# EAGLE design Bracelet (EAGLE 7.1.0)
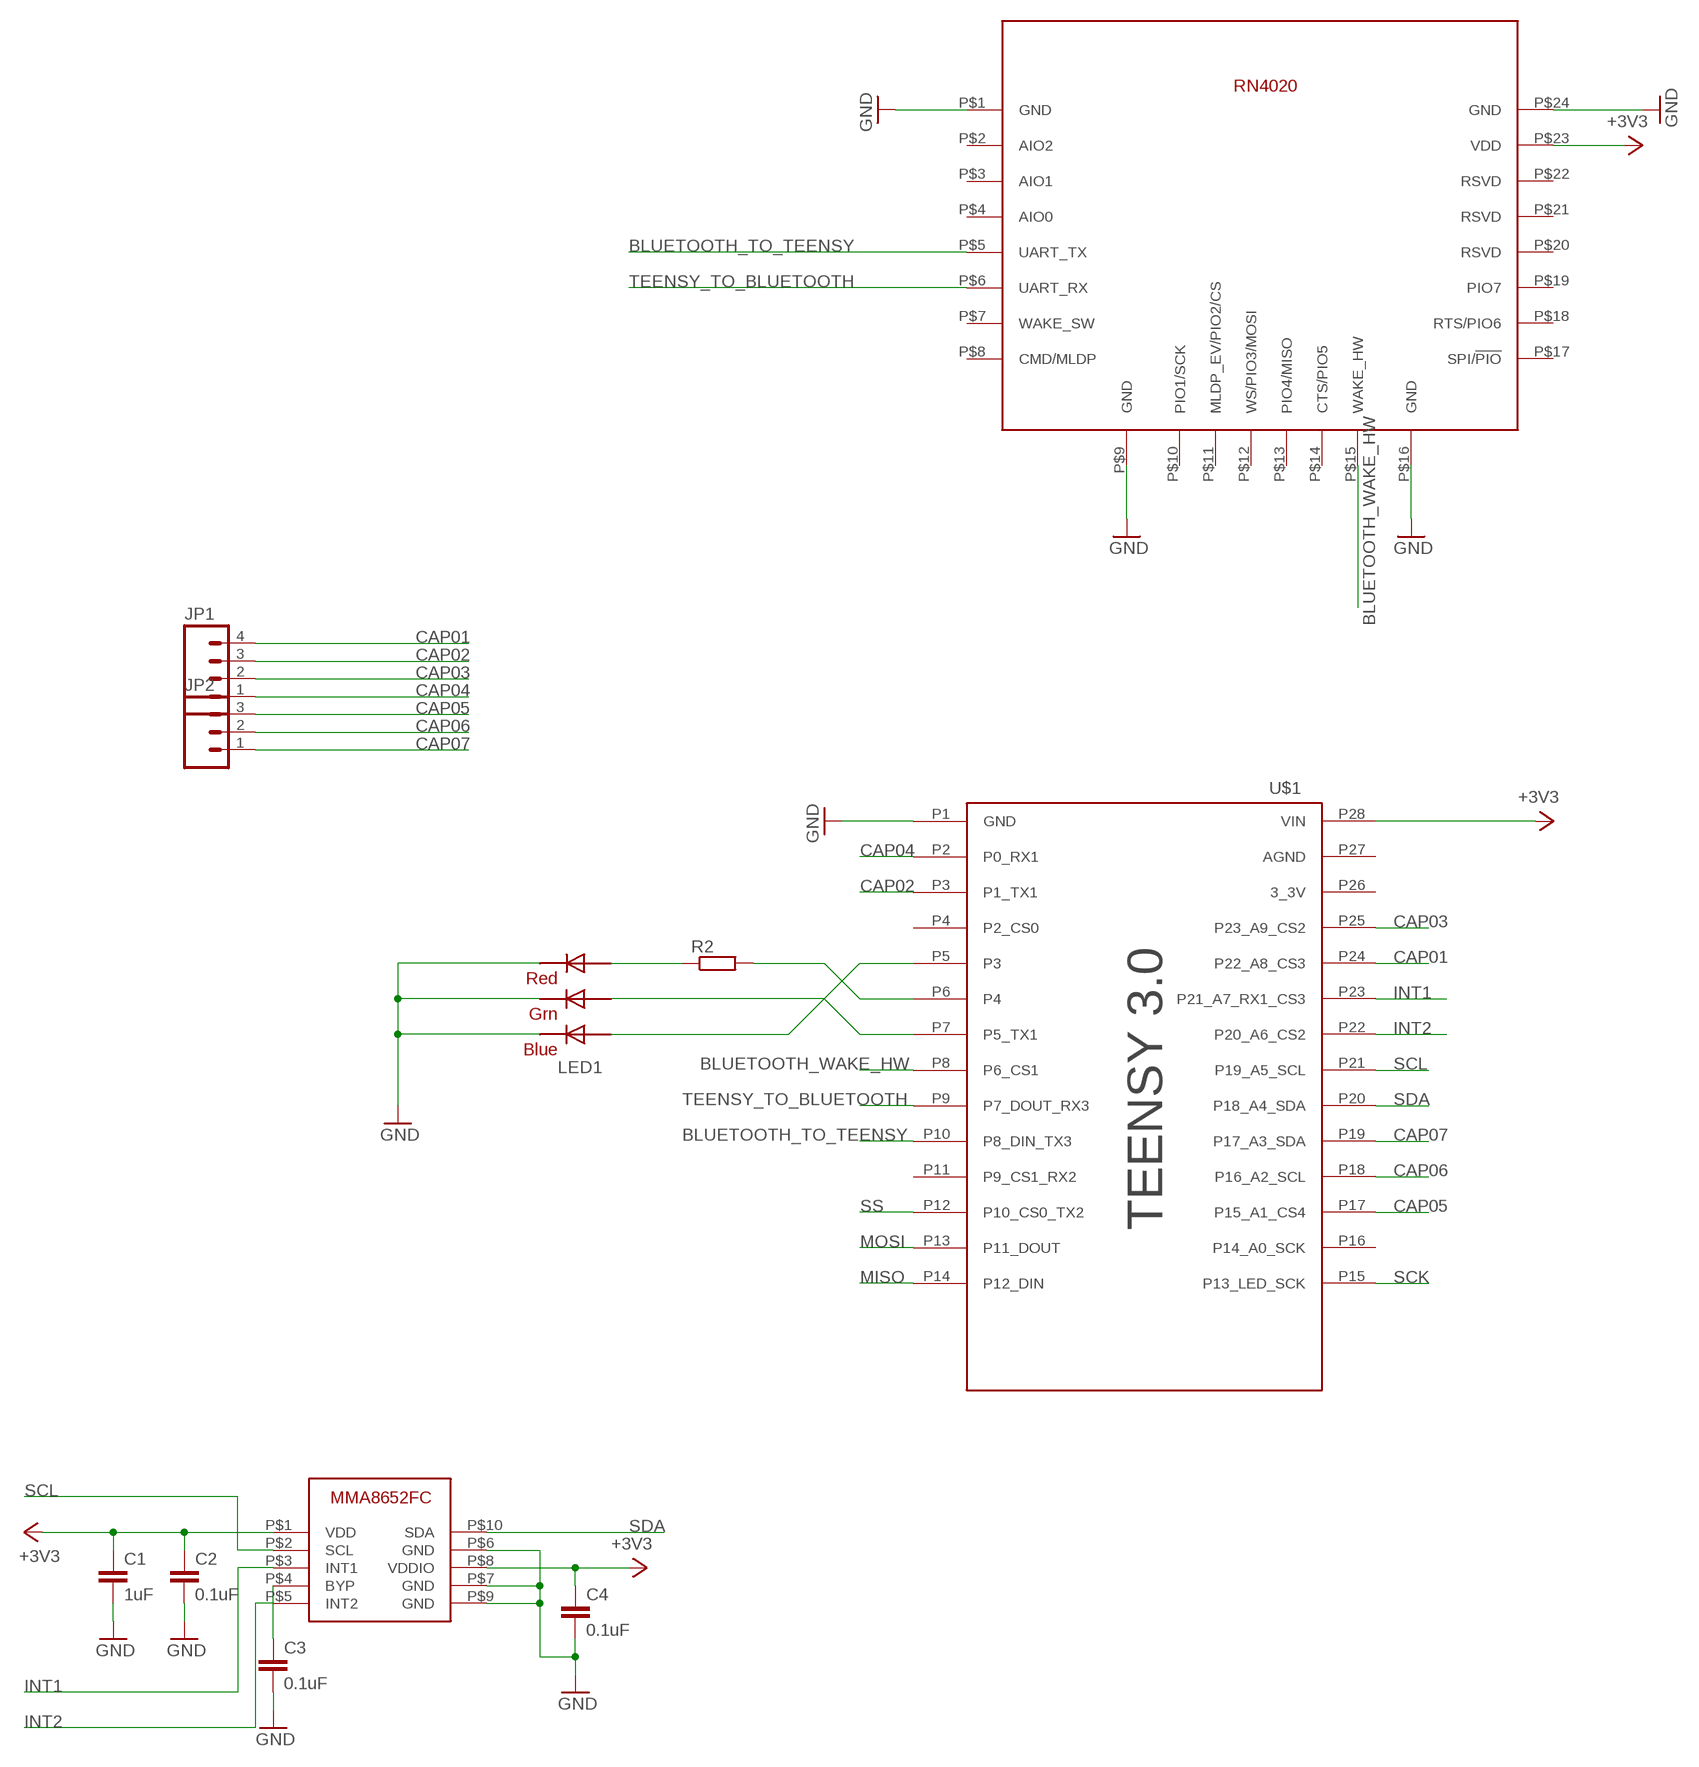
[diagram p0: schematic, sheet 1]

## Parts
C1  1uF  C-EUC0805  [C0805]
C2  0.1uF  C-EUC0805  [C0805]
C3  0.1uF  C-EUC0805  [C0805]
C4  0.1uF  C-EUC0805  [C0805]
JP1  M04PTH  [1X04]
JP2  M03PTH  [1X03]
LED1  RGBLED5050  [RGBLED5050]
R2  R-EU_R0805  [R0805]
RN4020  RN4020  [RN4020]
U$1  TEENSY3  [TEENSY3_BRD]
U$3  MMA8652FC  [MMA8652FC]

## Nets
+3V3: C1.1 C2.1 C4.1 RN4020.P$23(VDD) U$1.P28(VIN) U$3.P$1(VDD) U$3.P$8(VDDIO)
BLUETOOTH_TO_TEENSY: RN4020.P$5(UART_TX) U$1.P10(P8_DIN_TX3)
BLUETOOTH_WAKE_HW: RN4020.P$15(WAKE_HW) U$1.P8(P6_CS1)
CAP01: JP1.4 U$1.P24(P22_A8_CS3)
CAP02: JP1.3 U$1.P3(P1_TX1)
CAP03: JP1.2 U$1.P25(P23_A9_CS2)
CAP04: JP1.1 U$1.P2(P0_RX1)
CAP05: JP2.3 U$1.P17(P15_A1_CS4)
CAP06: JP2.2 U$1.P18(P16_A2_SCL)
CAP07: JP2.1 U$1.P19(P17_A3_SDA)
GND: C1.2 C2.2 C3.2 C4.2 LED1.4(BLUE_C) LED1.5(RED_C) LED1.6(GREEN_C) RN4020.P$1(GND) RN4020.P$9(GND) RN4020.P$16(GND) RN4020.P$24(GND) U$1.P1(GND) U$3.P$6(GND) U$3.P$7(GND) U$3.P$9(GND)
INT1: U$1.P23(P21_A7_RX1_CS3) U$3.P$3(INT1)
INT2: U$1.P22(P20_A6_CS2) U$3.P$5(INT2)
MISO: U$1.P14(P12_DIN)
MOSI: U$1.P13(P11_DOUT)
N$1: C3.1 U$3.P$4(BYP)
N$2: LED1.2(RED_A) R2.1
N$4: R2.2 U$1.P6(P4)
N$5: LED1.3(BLUE_A) U$1.P5(P3)
N$6: LED1.1(GREEN_A) U$1.P7(P5_TX1)
SCK: U$1.P15(P13_LED_SCK)
SCL: U$1.P21(P19_A5_SCL) U$3.P$2(SCL)
SDA: U$1.P20(P18_A4_SDA) U$3.P$10(SDA)
SS: U$1.P12(P10_CS0_TX2)
TEENSY_TO_BLUETOOTH: RN4020.P$6(UART_RX) U$1.P9(P7_DOUT_RX3)
Unconnected: RN4020.P$2(AIO2) RN4020.P$3(AIO1) RN4020.P$4(AIO0) RN4020.P$7(WAKE_SW) RN4020.P$8(CMD/MLDP) RN4020.P$10(PIO1/SCK) RN4020.P$11(MLDP_EV/PIO2/CS) RN4020.P$12(WS/PIO3/MOSI) RN4020.P$13(PIO4/MISO) RN4020.P$14(CTS/PIO5) RN4020.P$17(SPI/!PIO) RN4020.P$18(RTS/PIO6) RN4020.P$19(PIO7) RN4020.P$20(RSVD) RN4020.P$21(RSVD) RN4020.P$22(RSVD) U$1.P4(P2_CS0) U$1.P11(P9_CS1_RX2) U$1.P16(P14_A0_SCK) U$1.P26(3_3V) U$1.P27(AGND)

## Library data of the parts
C1-C4 = rcl:C-EU: CAPACITOR, European symbol
JP1 = SparkFun-Connectors:M04: Header 4 Standard 4-pin 0.1" header. Use with straight break away headers (SKU : PRT-00116), right angle break away headers (PRT-00553), swiss pins (PRT-00743), machine pins (PRT-00117), and female headers (PRT-00115). Molex polarized connector foot print use with SKU : PRT-08231 with associated crimp pins and housings. 1MM SMD Version SKU: PRT-10208
JP2 = SparkFun-Connectors:M03: Header 3 Standard 3-pin 0.1" header. Use with straight break away headers (SKU : PRT-00116), right angle break away headers (PRT-00553), swiss pins (PRT-00743), machine pins (PRT-00117), and female headers (PRT-00115). Molex polarized connector foot print use with SKU : PRT-08232 with associated crimp pins and housings.
LED1 = adafruit:RGBLED: For 5050 RGB LEDs, the order of the LEDs may vary from one manufacturer to another!
R2 = resistor:R-EU_: RESISTOR, European symbol
RN4020 = talons:RN4020: RN4020 Bluetooth Low Energy Module http://www.microchip.com/wwwproducts/Devices.aspx?product=RN4020
U$1 = teensy_base_compatible:TEENSY3
U$3 = talons:MMA8652FC

## Board
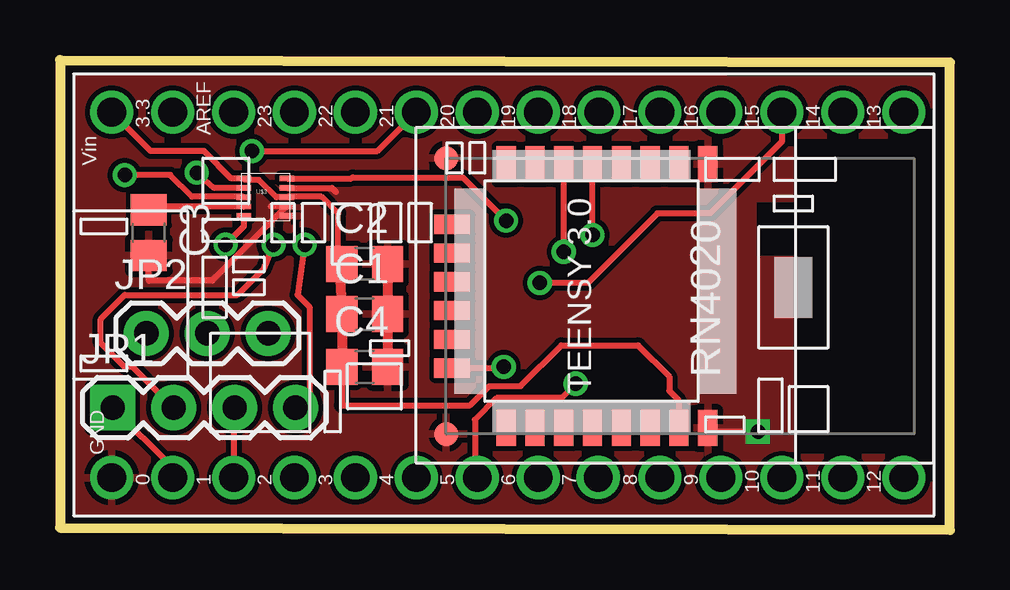
[diagram p1: board, top side]
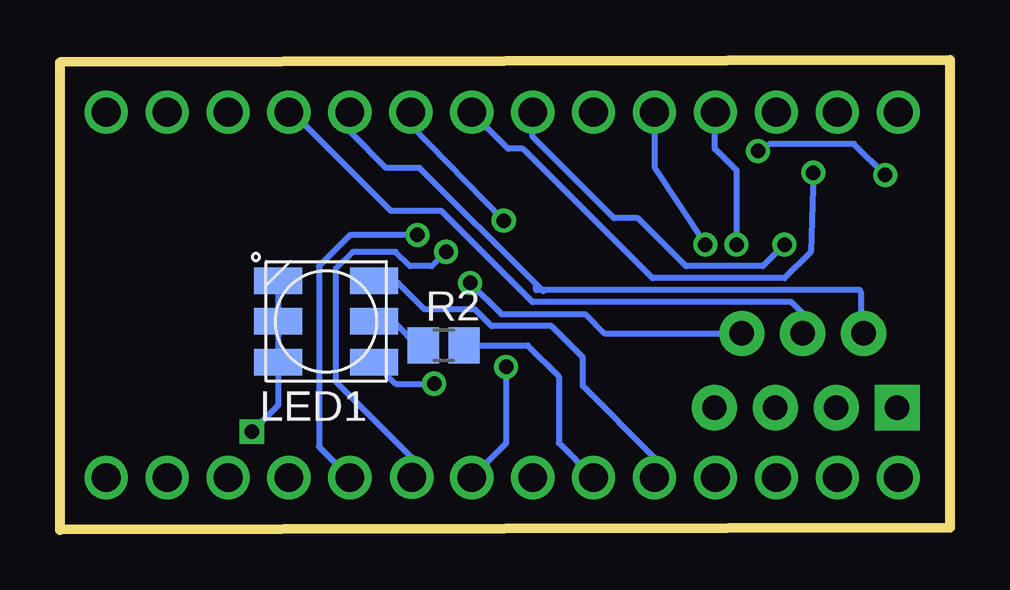
[diagram p2: board, bottom side, seen from below]

Size 37.1 x 19.6 mm. Coordinates in mm from the lower left corner, seen from the top.
Outline: 0,0.1 37.1,0 37.1,19.5 0,19.6 0,0.1
Copper layers (1*16): Top 0.0178mm / dielectric 59mil / Bottom 0.0178mm
Design rules "epl-lpkf": minimum track width 8mil, minimum drill 0.35mm, track to track 8mil, track to pad 8mil, pad to pad 8mil, via to via 8mil, smd to smd 8mil, copper to edge 15mil, drill to drill 15mil, minimum pad ring 8mil, minimum via ring 8mil, stop-mask expansion 3mil, vias tented up to drill 0mil, thermal gap 10mil
tRestrict: area 30.6,3.2 to 36.8,16.3

### Footprints (pad centres in the part's own frame; a part is rotated, then mirrored left to right if it is on the bottom)
C0805 = smd 1.3 x 1.5: 1 -0.95,0; 2 0.95,0
1X04 = drill 1.016 pad 1.88 square: 1 0,0 | drill 1.016 pad 1.88: 2 2.54,0; 3 5.08,0; 4 7.62,0
1X03 = drill 1.016 pad 1.88: 1 0,0; 2 2.54,0; 3 5.08,0
RGBLED5050 = smd 2 x 1.1: 1 -2,1.7; 2 -2,0; 3 -2,-1.7; 4 2,-1.7; 5 2,0; 6 2,1.7
R0805 = smd 1.3 x 1.5: 1 -0.85,0; 2 0.85,0
RN4020 = smd 1.5 x 0.8: P$1 0.25,10.9; P$2 0.25,9.7; P$3 0.25,8.5; P$4 0.25,7.3; P$5 0.25,6.1; P$6 0.25,4.9; P$7 0.25,3.7; P$8 0.25,2.5; P$17 11.25,2.5; P$18 11.25,3.7; P$19 11.25,4.9; P$20 11.25,6.1; P$21 11.25,7.3; P$22 11.25,8.5; P$23 11.25,9.7; P$24 11.25,10.9 | smd 1 x 1: P$9 0,0; P$16 11.5,0 | smd 0.8 x 1.5: P$10 2.75,0.25; P$11 3.95,0.25; P$12 5.15,0.25; P$13 6.35,0.25; P$14 7.55,0.25; P$15 8.75,0.25
TEENSY3_BRD = drill 1.2: P1 -7.62,17.145; P2 -7.62,14.605; P3 -7.62,12.065; P4 -7.62,9.525; P5 -7.62,6.985; P6 -7.62,4.445; P7 -7.62,1.905; P8 -7.62,-0.635; P9 -7.612,-3.135; P10 -7.62,-5.715; P11 -7.62,-8.255; P12 -7.62,-10.795; P13 -7.62,-13.335; P14 -7.62,-15.875; P15 7.62,-15.875; P16 7.62,-13.335; P17 7.62,-10.795; P18 7.62,-8.255; P19 7.62,-5.715; P20 7.62,-3.175; P21 7.62,-0.635; P22 7.62,1.905; P23 7.62,4.445; P24 7.62,6.985; P25 7.62,9.525; P26 7.62,12.065; P27 7.62,14.605; P28 7.62,17.145
MMA8652FC = smd 0.6 x 0.225: P$1 0.362,1.755; P$2 0.362,1.365; P$3 0.362,0.975; P$4 0.362,0.585; P$5 0.362,0.195; P$6 2.163,0.195; P$7 2.163,0.585; P$8 2.163,0.975; P$9 2.163,1.365; P$10 2.163,1.755

### Placement (x,y rotation side)
C1  12.7,9 0 top
C2  12.7,11.1 0 top
C3  3.7,12.4 270 top
C4  12.7,6.8 0 top
JP1  2.2,5.1 0 top
JP2  3.6,8.2 0 top
LED1  26,8.7 180 bottom
R2  21.1,7.7 0 bottom
RN4020  16.1,15.5 270 top
U$1  19.3,9.8 90 top
U$3  7.3,12.9 0 top

### Tracks (layer width: path | path; a pad name or v marks a point on that pad's centre or on a via)
+3V3
  Top 0.254: C2.1 11.65,11.05 11.6,11.1 | 11.6,11.1 11.65,10.8 | 11.6,11.1 11.6,13.2 10.9,13.9 9.49,13.9 U$3.P$8 9.02,13.88 8.3,14.6 7.72,14.6 U$3.P$1 7.15,14.66 6,15.8 3.77,15.8 U$1.P28 | C4.1 11.75,5.2 17.1,5.2 17.9,6 19.2,6 20.9,7.7 24.1,7.7 25.4,6.4 25.4,5.8 25.8,5.4 RN4020.P$23
  Top 0.406: 11.65,10.8 C1.1 C4.1
BLUETOOTH_TO_TEENSY  (via drill 0.6)
  Top 0.254: v22.2,12.3 RN4020.P$5
  Bottom 0.254: U$1.P10 26.3,3.46 26.3,11 25,12.3 v22.2,12.3
BLUETOOTH_WAKE_HW  (via drill 0.6)
  Top 0.254: RN4020.P$15 18.45,6.75 v18.5,6.8
  Bottom 0.254: v18.5,6.8 18.5,3.62 U$1.P8
CAP01  (via drill 0.6)
  Top 0.254: JP1.4 10.4,5.68 10.4,9.3 9.9,9.8 v10.2,11.9
  Bottom 0.254: U$1.P24 12.31,15.12 v10.2,11.9
CAP02
  Top 0.254: JP1.3 7.23,5.05 U$1.P3
CAP03  (via drill 0.6)
  Top 0.254: JP1.2 3.04,6.8 2.7,6.8 1.7,7.8 1.7,8.8 2.7,9.8 7.4,9.8 8.5,10.9 v8.9,11.9
  Bottom 0.254: U$1.P25 9.8,17.4 9.8,15.9 8.9,15 v8.9,11.9
CAP04
  Top 0.254: JP1.1 4.7,2.61 U$1.P2
CAP05  (via drill 0.6)
  Top 0.254: U$1.P17 30.09,16.2 27.1,13.2 24.9,13.2 22,10.3 v20,10.3
  Bottom 0.254: 8.88,8 JP2.3 14.4,8.2 15.2,9 18.7,9 v20,10.3
CAP06
  Bottom 0.254: JP2.2 6.1,8.24 6.1,9 6.6,9.5 17.4,9.5 21.2,13.3 23.3,13.3 27.42,17.42 U$1.P18 27.52,17.42
CAP07
  Bottom 0.254: 17.25,10.25 22.1,15.1 23.5,15.1 25.02,16.62 U$1.P19 | 17.25,10.25 16.95,9.95 | JP2.1 3.7,8.3 3.7,9.9 3.75,9.95 3.75,10 17.25,10 17.25,10.25
GND  (via drill 0.6)
  Top 0.254: U$3.P$9 11.34,14.27 11.5,14.1 | v29.1,4.1 27.15,4.1 RN4020.P$24 | U$3.P$7 9.45,13.5 | 9.45,13.5 8.8,13.5 | 9.45,13.5 6.35,10.4 3.7,10.4 C3.2
  Top 0.406: C2.2 C1.2 C4.2
  Bottom 0.254: LED1.4 LED1.5 LED1.6 28,5.2 v29.1,4.1
  pour Top: -19.4,-0.2 50.4,-0.2 50.3,25.4 -19.3,25.6 -19.4,4.4
INT1  (via drill 0.6)
  Top 0.254: U$3.P$3 7.64,13.9 5.5,13.9 4.6,14.8 v2.7,14.8 | v8,15.8 13.23,15.8 U$1.P23
  Bottom 0.254: v2.7,14.8 4,16.1 7.5,16.1 v8,15.8
INT2  (via drill 0.6)
  Top 0.254: U$3.P$5 7.66,12.66 v6.9,11.9
  Bottom 0.254: U$1.P22 17.4,16.4 14,13 13,13 11,11 7.8,11 v6.9,11.9
N$1
  Top 0.254: U$3.P$4 3.84,13.48 C3.1
N$2
  Bottom 0.254: R2.1 22.1,7.6 23.2,8.7 LED1.2
N$4
  Bottom 0.254: U$1.P6 16.3,3.62 16.3,6.4 17.6,7.7 R2.2
N$5
  Bottom 0.254: U$1.P5 12.31,3.02 15.3,6 15.3,7.2 16.6,8.5 19.1,8.5 19.8,9.2 21.9,9.2 23,10.3 23.9,10.3 LED1.3
N$6  (via drill 0.6)
  Top 0.254: v21.5,6.1 20.9,5.5 18.2,5.5 17.3,4.6 17.3,2.28 U$1.P7
  Bottom 0.254: LED1.1 23.1,6.1 v21.5,6.1
SCL  (via drill 0.6)
  Top 0.254: U$3.P$2 6.44,14.27 v5.7,14.9
  Bottom 0.254: v5.7,14.9 5.8,11.6 6.9,10.5 12.4,10.5 17.8,15.9 18.41,15.9 U$1.P21
SDA  (via drill 0.6)
  Top 0.254: U$3.P$10 12.16,14.66 12.2,14.7 16.8,14.7 v18.6,12.9
  Bottom 0.254: v18.6,12.9 22.48,16.88 U$1.P20
TEENSY_TO_BLUETOOTH  (via drill 0.6)
  Top 0.254: v21,11.6 RN4020.P$6
  Bottom 0.254: U$1.P9 22.44,3.04 25.6,6.2 25.6,10.9 24.9,11.6 23.1,11.6 22.5,11 21.6,11 v21,11.6